# Altium project PCB_Project.PrjPcb
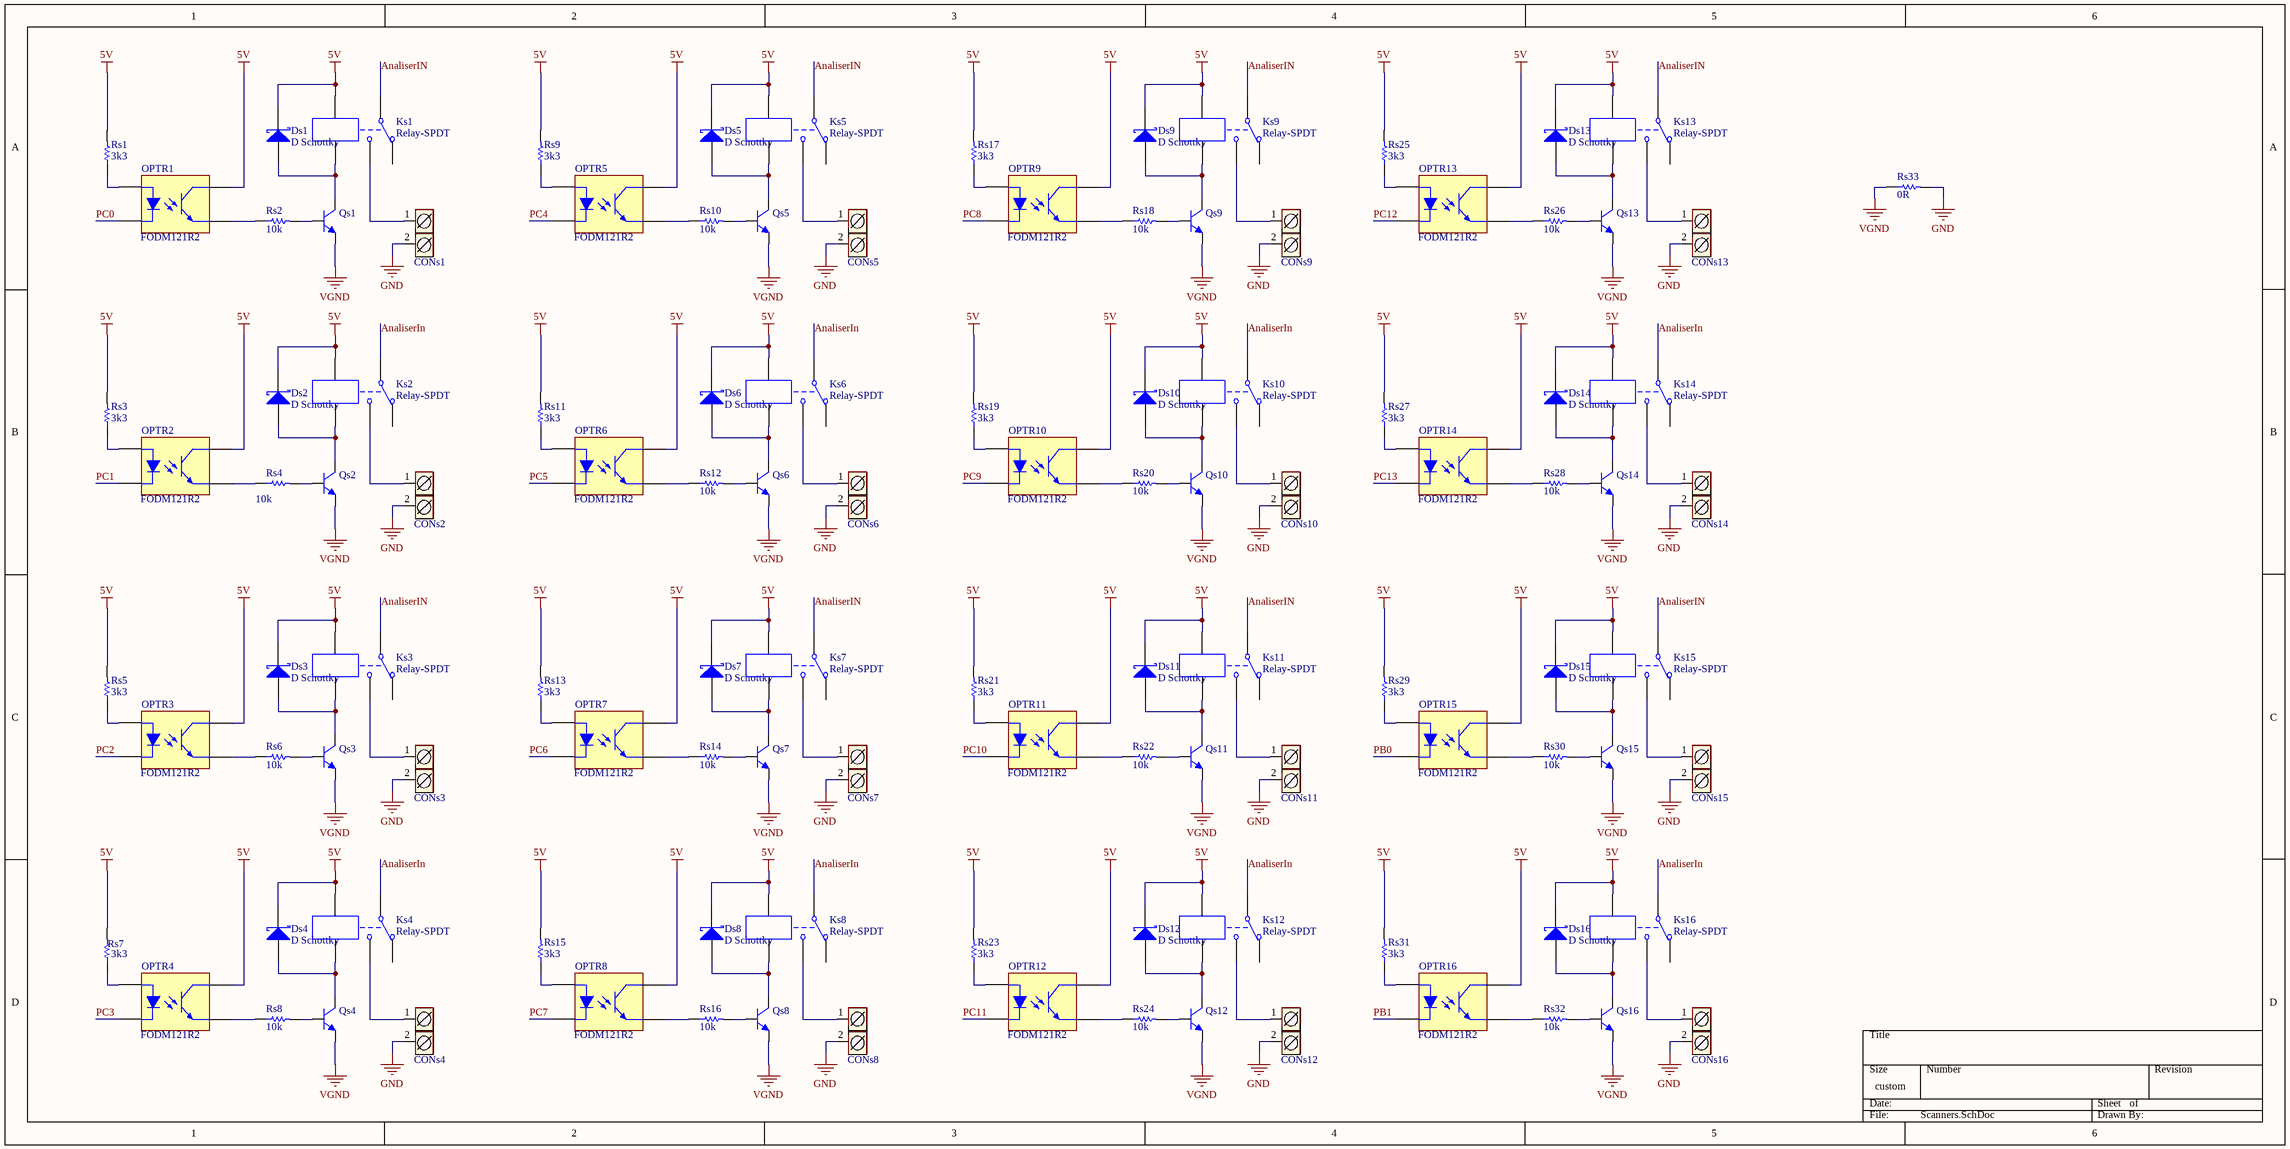
[diagram p0: Scanners.SchDoc]
5 sheets, 192 parts. Net scope: global (net labels, ports and power ports of the same name join across sheets).
Board file: PCB2.PcbDoc
Sheets:
  Scanners.SchDoc
  Connectors.SchDoc
  MCU.SchDoc
  Analiser.SchDoc
  Misc.SchDoc

## Sheet Scanners.SchDoc
size 508 x 254 mm

### Parts
CONs1  ARK2  [ARK2]  (value not drawn)
CONs2  ARK2  [ARK2]  (value not drawn)
CONs3  ARK2  [ARK2]  (value not drawn)
CONs4  ARK2  [ARK2]  (value not drawn)
CONs5  ARK2  [ARK2]  (value not drawn)
CONs6  ARK2  [ARK2]  (value not drawn)
CONs7  ARK2  [ARK2]  (value not drawn)
CONs8  ARK2  [ARK2]  (value not drawn)
CONs9  ARK2  [ARK2]  (value not drawn)
CONs10  ARK2  [ARK2]  (value not drawn)
CONs11  ARK2  [ARK2]  (value not drawn)
CONs12  ARK2  [ARK2]  (value not drawn)
CONs13  ARK2  [ARK2]  (value not drawn)
CONs14  ARK2  [ARK2]  (value not drawn)
CONs15  ARK2  [ARK2]  (value not drawn)
CONs16  ARK2  [ARK2]  (value not drawn)
Ds1  D Schottky  [SMA]
Ds2  D Schottky  [SMA]
Ds3  D Schottky  [SMA]
Ds4  D Schottky  [SMA]
Ds5  D Schottky  [SMA]
Ds6  D Schottky  [SMA]
Ds7  D Schottky  [SMA]
Ds8  D Schottky  [SMA]
Ds9  D Schottky  [SMA]
Ds10  D Schottky  [SMA]
Ds11  D Schottky  [SMA]
Ds12  D Schottky  [SMA]
Ds13  D Schottky  [SMA]
Ds14  D Schottky  [SMA]
Ds15  D Schottky  [SMA]
Ds16  D Schottky  [SMA]
Ks1  Relay-SPDT  [Relay_m1]
Ks2  Relay-SPDT  [Relay_m1]
Ks3  Relay-SPDT  [Relay_m1]
Ks4  Relay-SPDT  [Relay_m1]
Ks5  Relay-SPDT  [Relay_m1]
Ks6  Relay-SPDT  [Relay_m1]
Ks7  Relay-SPDT  [Relay_m1]
Ks8  Relay-SPDT  [Relay_m1]
Ks9  Relay-SPDT  [Relay_m1]
Ks10  Relay-SPDT  [Relay_m1]
Ks11  Relay-SPDT  [Relay_m1]
Ks12  Relay-SPDT  [Relay_m1]
Ks13  Relay-SPDT  [Relay_m1]
Ks14  Relay-SPDT  [Relay_m1]
Ks15  Relay-SPDT  [Relay_m1]
Ks16  Relay-SPDT  [Relay_m1]
OPTR1  FODM121R2  [FAIR-MFP 4L_V]
OPTR2  FODM121R2  [FAIR-MFP 4L_V]
OPTR3  FODM121R2  [FAIR-MFP 4L_V]
OPTR4  FODM121R2  [FAIR-MFP 4L_V]
OPTR5  FODM121R2  [FAIR-MFP 4L_V]
OPTR6  FODM121R2  [FAIR-MFP 4L_V]
OPTR7  FODM121R2  [FAIR-MFP 4L_V]
OPTR8  FODM121R2  [FAIR-MFP 4L_V]
OPTR9  FODM121R2  [FAIR-MFP 4L_V]
OPTR10  FODM121R2  [FAIR-MFP 4L_V]
OPTR11  FODM121R2  [FAIR-MFP 4L_V]
OPTR12  FODM121R2  [FAIR-MFP 4L_V]
OPTR13  FODM121R2  [FAIR-MFP 4L_V]
OPTR14  FODM121R2  [FAIR-MFP 4L_V]
OPTR15  FODM121R2  [FAIR-MFP 4L_V]
OPTR16  FODM121R2  [FAIR-MFP 4L_V]
Qs1  BC817-25  [SOT23_N]  (value not drawn)
Qs2  BC817-25  [SOT23_N]  (value not drawn)
Qs3  BC817-25  [SOT23_N]  (value not drawn)
Qs4  BC817-25  [SOT23_N]  (value not drawn)
Qs5  BC817-25  [SOT23_N]  (value not drawn)
Qs6  BC817-25  [SOT23_N]  (value not drawn)
Qs7  BC817-25  [SOT23_N]  (value not drawn)
Qs8  BC817-25  [SOT23_N]  (value not drawn)
Qs9  BC817-25  [SOT23_N]  (value not drawn)
Qs10  BC817-25  [SOT23_N]  (value not drawn)
Qs11  BC817-25  [SOT23_N]  (value not drawn)
Qs12  BC817-25  [SOT23_N]  (value not drawn)
Qs13  BC817-25  [SOT23_N]  (value not drawn)
Qs14  BC817-25  [SOT23_N]  (value not drawn)
Qs15  BC817-25  [SOT23_N]  (value not drawn)
Qs16  BC817-25  [SOT23_N]  (value not drawn)
Rs1  3k3  [RESC0603(1608)_L]
Rs2  10k  [RESC0603(1608)_L]
Rs3  3k3  [RESC0603(1608)_L]
Rs4  10k  [RESC0603(1608)_L]
Rs5  3k3  [RESC0603(1608)_L]
Rs6  10k  [RESC0603(1608)_L]
Rs7  3k3  [RESC0603(1608)_L]
Rs8  10k  [RESC0603(1608)_L]
Rs9  3k3  [RESC0603(1608)_L]
Rs10  10k  [RESC0603(1608)_L]
Rs11  3k3  [RESC0603(1608)_L]
Rs12  10k  [RESC0603(1608)_L]
Rs13  3k3  [RESC0603(1608)_L]
Rs14  10k  [RESC0603(1608)_L]
Rs15  3k3  [RESC0603(1608)_L]
Rs16  10k  [RESC0603(1608)_L]
Rs17  3k3  [RESC0603(1608)_L]
Rs18  10k  [RESC0603(1608)_L]
Rs19  3k3  [RESC0603(1608)_L]
Rs20  10k  [RESC0603(1608)_L]
Rs21  3k3  [RESC0603(1608)_L]
Rs22  10k  [RESC0603(1608)_L]
Rs23  3k3  [RESC0603(1608)_L]
Rs24  10k  [RESC0603(1608)_L]
Rs25  3k3  [RESC0603(1608)_L]
Rs26  10k  [RESC0603(1608)_L]
Rs27  3k3  [RESC0603(1608)_L]
Rs28  10k  [RESC0603(1608)_L]
Rs29  3k3  [RESC0603(1608)_L]
Rs30  10k  [RESC0603(1608)_L]
Rs31  3k3  [RESC0603(1608)_L]
Rs32  10k  [RESC0603(1608)_L]
Rs33  0R  [RESC0603(1608)_L]

### Nets
5V: Ds1.2(K) Ds2.2(K) Ds3.2(K) Ds4.2(K) Ds5.2(K) Ds6.2(K) Ds7.2(K) Ds8.2(K) Ds9.2(K) Ds10.2(K) Ds11.2(K) Ds12.2(K) Ds13.2(K) Ds14.2(K) Ds15.2(K) Ds16.2(K) Ks1.4 Ks2.4 Ks3.4 Ks4.4 Ks5.4 Ks6.4 Ks7.4 Ks8.4 Ks9.4 Ks10.4 Ks11.4 Ks12.4 Ks13.4 Ks14.4 Ks15.4 Ks16.4 OPTR1.4(COLLECTOR) OPTR2.4(COLLECTOR) OPTR3.4(COLLECTOR) OPTR4.4(COLLECTOR) OPTR5.4(COLLECTOR) OPTR6.4(COLLECTOR) OPTR7.4(COLLECTOR) OPTR8.4(COLLECTOR) OPTR9.4(COLLECTOR) OPTR10.4(COLLECTOR) OPTR11.4(COLLECTOR) OPTR12.4(COLLECTOR) OPTR13.4(COLLECTOR) OPTR14.4(COLLECTOR) OPTR15.4(COLLECTOR) OPTR16.4(COLLECTOR) Rs1.2 Rs3.2 Rs5.2 Rs7.2 Rs9.2 Rs11.2 Rs13.2 Rs15.2 Rs17.2 Rs19.2 Rs21.2 Rs23.2 Rs25.2 Rs27.2 Rs29.2 Rs31.2
GND: CONs1.2 CONs2.2 CONs3.2 CONs4.2 CONs5.2 CONs6.2 CONs7.2 CONs8.2 CONs9.2 CONs10.2 CONs11.2 CONs12.2 CONs13.2 CONs14.2 CONs15.2 CONs16.2 Rs33.2
VGND: Qs1.2(E) Qs2.2(E) Qs3.2(E) Qs4.2(E) Qs5.2(E) Qs6.2(E) Qs7.2(E) Qs8.2(E) Qs9.2(E) Qs10.2(E) Qs11.2(E) Qs12.2(E) Qs13.2(E) Qs14.2(E) Qs15.2(E) Qs16.2(E) Rs33.1
AnaliserIN: Ks1.1 Ks2.1 Ks3.1 Ks4.1 Ks5.1 Ks6.1 Ks7.1 Ks8.1 Ks9.1 Ks10.1 Ks11.1 Ks12.1 Ks13.1 Ks14.1 Ks15.1 Ks16.1
PB0: OPTR15.2(CATHODE)
PB1: OPTR16.2(CATHODE)
PC0: OPTR1.2(CATHODE)
PC1: OPTR2.2(CATHODE)
PC2: OPTR3.2(CATHODE)
PC3: OPTR4.2(CATHODE)
PC4: OPTR5.2(CATHODE)
PC5: OPTR6.2(CATHODE)
PC6: OPTR7.2(CATHODE)
PC7: OPTR8.2(CATHODE)
PC8: OPTR9.2(CATHODE)
PC9: OPTR10.2(CATHODE)
PC10: OPTR11.2(CATHODE)
PC11: OPTR12.2(CATHODE)
PC12: OPTR13.2(CATHODE)
PC13: OPTR14.2(CATHODE)
NetCONs1_1: CONs1.1 Ks1.3
NetCONs2_1: CONs2.1 Ks2.3
NetCONs3_1: CONs3.1 Ks3.3
NetCONs4_1: CONs4.1 Ks4.3
NetCONs5_1: CONs5.1 Ks5.3
NetCONs6_1: CONs6.1 Ks6.3
NetCONs7_1: CONs7.1 Ks7.3
NetCONs8_1: CONs8.1 Ks8.3
NetCONs9_1: CONs9.1 Ks9.3
NetCONs10_1: CONs10.1 Ks10.3
NetCONs11_1: CONs11.1 Ks11.3
NetCONs12_1: CONs12.1 Ks12.3
NetCONs13_1: CONs13.1 Ks13.3
NetCONs14_1: CONs14.1 Ks14.3
NetCONs15_1: CONs15.1 Ks15.3
NetCONs16_1: CONs16.1 Ks16.3
NetDs1_1: Ds1.1(A) Ks1.5 Qs1.3(C)
NetDs2_1: Ds2.1(A) Ks2.5 Qs2.3(C)
NetDs3_1: Ds3.1(A) Ks3.5 Qs3.3(C)
NetDs4_1: Ds4.1(A) Ks4.5 Qs4.3(C)
NetDs5_1: Ds5.1(A) Ks5.5 Qs5.3(C)
NetDs6_1: Ds6.1(A) Ks6.5 Qs6.3(C)
NetDs7_1: Ds7.1(A) Ks7.5 Qs7.3(C)
NetDs8_1: Ds8.1(A) Ks8.5 Qs8.3(C)
NetDs9_1: Ds9.1(A) Ks9.5 Qs9.3(C)
NetDs10_1: Ds10.1(A) Ks10.5 Qs10.3(C)
NetDs11_1: Ds11.1(A) Ks11.5 Qs11.3(C)
NetDs12_1: Ds12.1(A) Ks12.5 Qs12.3(C)
NetDs13_1: Ds13.1(A) Ks13.5 Qs13.3(C)
NetDs14_1: Ds14.1(A) Ks14.5 Qs14.3(C)
NetDs15_1: Ds15.1(A) Ks15.5 Qs15.3(C)
NetDs16_1: Ds16.1(A) Ks16.5 Qs16.3(C)
NetOPTR1_1: OPTR1.1(ANODE) Rs1.1
NetOPTR1_3: OPTR1.3(EMITTER) Rs2.1
NetOPTR2_1: OPTR2.1(ANODE) Rs3.1
NetOPTR2_3: OPTR2.3(EMITTER) Rs4.1
NetOPTR3_1: OPTR3.1(ANODE) Rs5.1
NetOPTR3_3: OPTR3.3(EMITTER) Rs6.1
NetOPTR4_1: OPTR4.1(ANODE) Rs7.1
NetOPTR4_3: OPTR4.3(EMITTER) Rs8.1
NetOPTR5_1: OPTR5.1(ANODE) Rs9.1
NetOPTR5_3: OPTR5.3(EMITTER) Rs10.1
NetOPTR6_1: OPTR6.1(ANODE) Rs11.1
NetOPTR6_3: OPTR6.3(EMITTER) Rs12.1
NetOPTR7_1: OPTR7.1(ANODE) Rs13.1
NetOPTR7_3: OPTR7.3(EMITTER) Rs14.1
NetOPTR8_1: OPTR8.1(ANODE) Rs15.1
NetOPTR8_3: OPTR8.3(EMITTER) Rs16.1
NetOPTR9_1: OPTR9.1(ANODE) Rs17.1
NetOPTR9_3: OPTR9.3(EMITTER) Rs18.1
NetOPTR10_1: OPTR10.1(ANODE) Rs19.1
NetOPTR10_3: OPTR10.3(EMITTER) Rs20.1
NetOPTR11_1: OPTR11.1(ANODE) Rs21.1
NetOPTR11_3: OPTR11.3(EMITTER) Rs22.1
NetOPTR12_1: OPTR12.1(ANODE) Rs23.1
NetOPTR12_3: OPTR12.3(EMITTER) Rs24.1
NetOPTR13_1: OPTR13.1(ANODE) Rs25.1
NetOPTR13_3: OPTR13.3(EMITTER) Rs26.1
NetOPTR14_1: OPTR14.1(ANODE) Rs27.1
NetOPTR14_3: OPTR14.3(EMITTER) Rs28.1
NetOPTR15_1: OPTR15.1(ANODE) Rs29.1
NetOPTR15_3: OPTR15.3(EMITTER) Rs30.1
NetOPTR16_1: OPTR16.1(ANODE) Rs31.1
NetOPTR16_3: OPTR16.3(EMITTER) Rs32.1
NetQs1_1: Qs1.1(B) Rs2.2
NetQs2_1: Qs2.1(B) Rs4.2
NetQs3_1: Qs3.1(B) Rs6.2
NetQs4_1: Qs4.1(B) Rs8.2
NetQs5_1: Qs5.1(B) Rs10.2
NetQs6_1: Qs6.1(B) Rs12.2
NetQs7_1: Qs7.1(B) Rs14.2
NetQs8_1: Qs8.1(B) Rs16.2
NetQs9_1: Qs9.1(B) Rs18.2
NetQs10_1: Qs10.1(B) Rs20.2
NetQs11_1: Qs11.1(B) Rs22.2
NetQs12_1: Qs12.1(B) Rs24.2
NetQs13_1: Qs13.1(B) Rs26.2
NetQs14_1: Qs14.1(B) Rs28.2
NetQs15_1: Qs15.1(B) Rs30.2
NetQs16_1: Qs16.1(B) Rs32.2

Not connected (* = marked no-connect by the designer): Ks1 2; Ks2 2; Ks3 2; Ks4 2; Ks5 2; Ks6 2; Ks7 2; Ks8 2; Ks9 2; Ks10 2; Ks11 2; Ks12 2; Ks13 2; Ks14 2; Ks15 2; Ks16 2

### Library data of the parts
CONs1-CONs16 = ARK2: Złącze śrubowe 2 piny
Ds1-Ds16 = D Schottky: Schottky Diode; Published: 8-Jun-2000; LatestRevisionDate: 17-Jul-2002; LatestRevisionNote: Re-released for DXP Platform.; PackageReference: SMB; Publisher: Altium Limited; PackageDescription: DO-214-AA/SMB; 2 C-Bend Leads; Body 5.3 x 3.6 mm, inc. leads (LxW); Code_JEDEC: DO-214-AA
Ks1-Ks16 = Relay-SPDT: Single-Pole Dual-Throw Relay; Published: 24-Mar-1999; LatestRevisionDate: 17-Jul-2002; LatestRevisionNote: Re-released for DXP Platform.; PackageReference: MODULE5B; Publisher: Altium Limited
OPTR1-OPTR16 = CMP-1569-00003-1: Transistor Output Optocoupler, 1 to 1.3 V, -40 to 110 degC, 4-Pin SOP (MFP 4L), RoHS, Tape and Reel; VCE Saturation Max: 0.4 V; Forward Voltage Max: 1.3 V; Forward Voltage Min: 1 V; ComponentLink3URL: https://www.fairchildsemi.com/package-drawings/MF/MFP04C.pdf; Temperature Max: 110 degC; RoHS: TRUE; DatasheetVersion: Rev. 1.1.4; Temperature Min: -40 degC; Mounting Technology: Surface Mount; ComponentLink2Description: Datasheet; ComponentLink2URL: https://www.fairchildsemi.com/datasheets/FO/FODM121.pdf; ComponentLink1Description: Manufacturer URL; ComponentLink1URL: https://www.fairchildsemi.com/; ComponentLink3Description: Package Specification; PartNumber: FODM121; Packing: Tape and Reel; PackageDescription: 4-Pin Mini Flat Package, Body 3.85 x 4.4 mm, Pitch 2.54 mm
Qs1-Qs16 = BC817-25: NPN General-purpose Transistor; Published: 17-Sep-2003; LatestRevisionDate: 12-Dec-2006; LatestRevisionNote: IPC-7351 Footprint Added.; DatasheetVersion: Jun-1999; PackageVersion: May-1999; PackageReference: SOT23; Publisher: Altium Limited; PackageDescription: 3-Pin SOT-23 Package 0.95 mm Pitch, 2.3 mm Lead Span; ComponentLink1Description: Manufacturer Link; ComponentLink1URL: http://www.semiconductors.philips.com/; ComponentLink2Description: Datasheet; ComponentLink2URL: http://www.semiconductors.philips.com/acrobat/datasheets/BC817_BC817W_BC337_5.pdf
Rs1-Rs33 = CMP-1591-00001-1: 0603 (1608 Metric) Chip Resistor; Case-Metric: 1608; Case-EIA: 0603; PackageReference: RESC0603(1608)

## Sheet Connectors.SchDoc
size A4
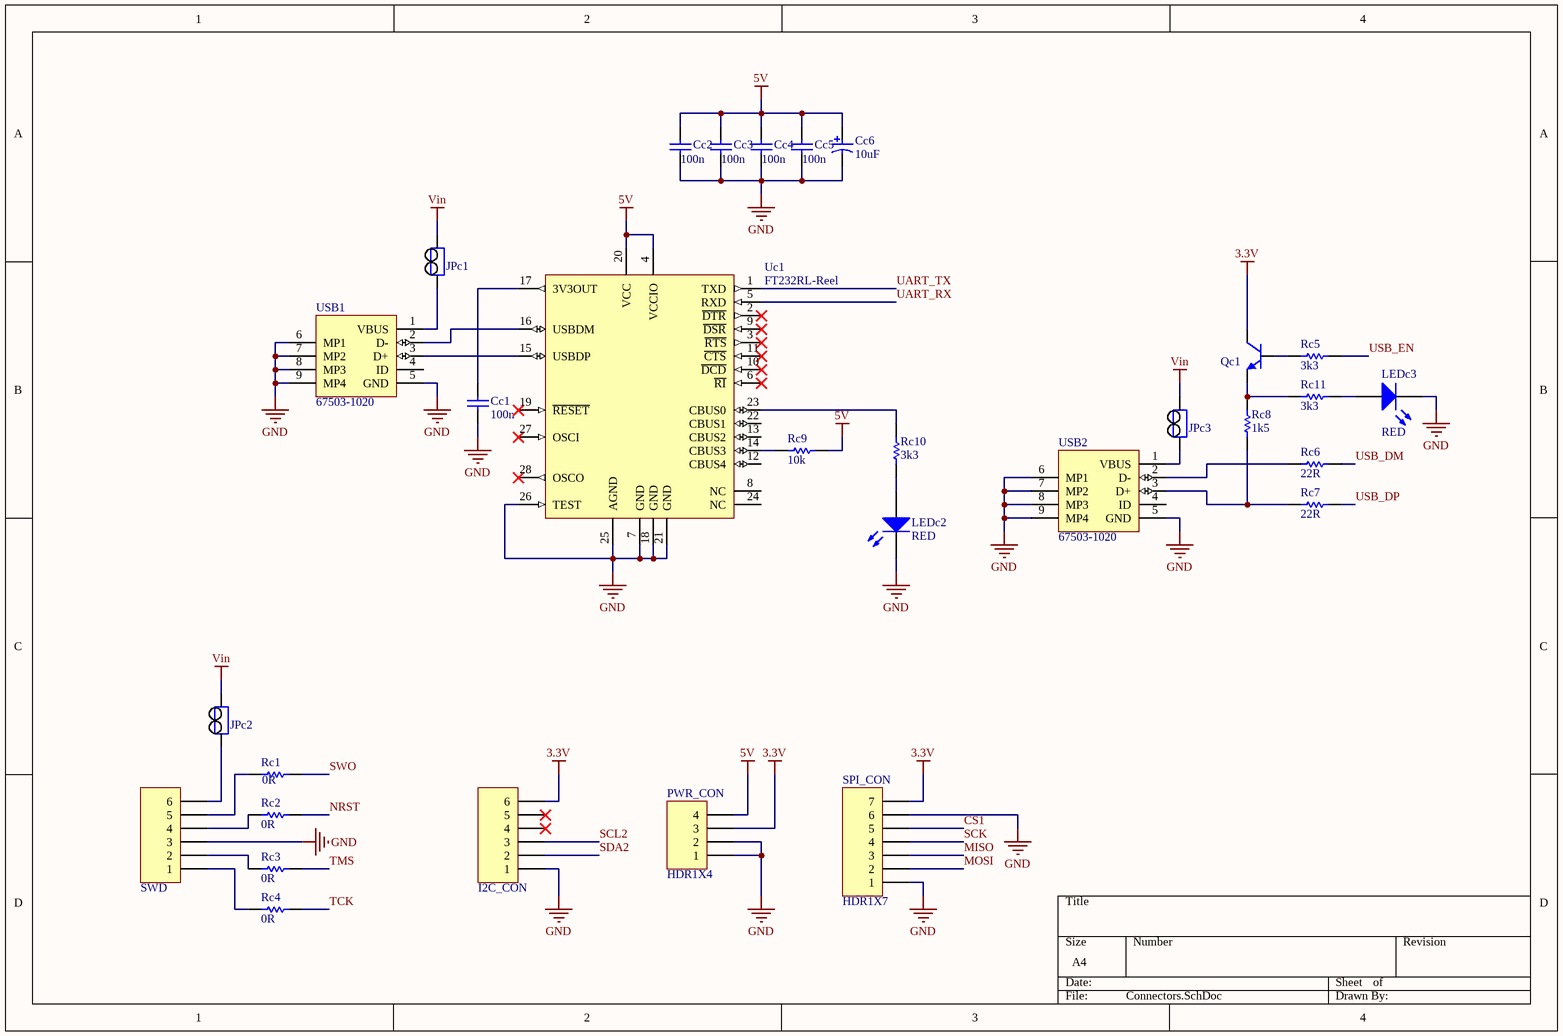
[diagram p1: Connectors.SchDoc]

### Parts
Cc1  100n  [CAPC0603(1608)100_L]
Cc2  100n  [CAPC0603(1608)100_L]
Cc3  100n  [CAPC0603(1608)100_L]
Cc4  100n  [CAPC0603(1608)100_L]
Cc5  100n  [CAPC0603(1608)100_L]
Cc6  10uF  [CAPMP3217X18-T_V]
I2C_CON  HDR1X6  [HDR1X6]  (value not drawn)
JPc1  Jumper  [HDR1X2 - JP]  (value not drawn)
JPc2  Jumper  [HDR1X2 - JP]  (value not drawn)
JPc3  Jumper  [HDR1X2 - JP]  (value not drawn)
LEDc2  RED  [0805_DIODE]
LEDc3  RED  [0805_DIODE]
PWR_CON  HDR1X4  [HDR1X4]
Qc1  BC817-25  [SOT23_N]  (value not drawn)
Rc1  0R  [RESC0603(1608)_L]
Rc2  0R  [RESC0603(1608)_L]
Rc3  0R  [RESC0603(1608)_L]
Rc4  0R  [RESC0603(1608)_L]
Rc5  3k3  [RESC0603(1608)_L]
Rc6  22R  [RESC0603(1608)_L]
Rc7  22R  [RESC0603(1608)_L]
Rc8  1k5  [RESC0603(1608)_L]
Rc9  10k  [RESC0603(1608)_L]
Rc10  3k3  [RESC0603(1608)_L]
Rc11  3k3  [RESC0603(1608)_L]
SPI_CON  HDR1X7  [HDR1X7]
SWD  HDR1X6  [HDR1X6]  (value not drawn)
Uc1  FT232RL-Reel  [SSOP-28_L]
USB1  67503-1020  [MOLX-67503-1020_V]
USB2  67503-1020  [MOLX-67503-1020_V]

### Nets
3.3V: I2C_CON.6 PWR_CON.3 Qc1.3(C) SPI_CON.7
5V: Cc2.2 Cc3.2 Cc4.2 Cc5.2 Cc6.1 PWR_CON.4 Rc9.1 Uc1.4(VCCIO) Uc1.20(VCC)
GND: Cc1.1 Cc2.1 Cc3.1 Cc4.1 Cc5.1 Cc6.2 I2C_CON.1 LEDc2.2(K) LEDc3.2(K) PWR_CON.1 PWR_CON.2 SPI_CON.1 SPI_CON.6 SWD.3 Uc1.7(GND) Uc1.18(GND) Uc1.21(GND) Uc1.25(AGND) Uc1.26(TEST) USB1.5(GND) USB1.6(MP1) USB1.7(MP2) USB1.8(MP3) USB1.9(MP4) USB2.5(GND) USB2.6(MP1) USB2.7(MP2) USB2.8(MP3) USB2.9(MP4)
Vin: JPc1.2 JPc2.2 JPc3.2
CS1: SPI_CON.5
MISO: SPI_CON.3
MOSI: SPI_CON.2
NRST: Rc2.2
SCK: SPI_CON.4
SCL2: I2C_CON.3
SDA2: I2C_CON.2
SWO: Rc1.2
TCK: Rc4.2
TMS: Rc3.2
UART_RX: Uc1.5(RXD)
UART_TX: Uc1.1(TXD)
USB_DM: Rc6.2
USB_DP: Rc7.2
USB_EN: Rc5.1
NetCc1_2: Cc1.2 Uc1.17(3V3OUT)
NetJPc1_1: JPc1.1 USB1.1(VBUS)
NetJPc2_1: JPc2.1 SWD.6
NetJPc3_1: JPc3.1 USB2.1(VBUS)
NetLEDc2_1: LEDc2.1(A) Rc10.1
NetLEDc3_1: LEDc3.1(A) Rc11.1
NetQc1_1: Qc1.1(B) Rc5.2
NetQc1_2: Qc1.2(E) Rc8.2 Rc11.2
NetRc1_1: Rc1.1 SWD.5
NetRc2_1: Rc2.1 SWD.4
NetRc3_1: Rc3.1 SWD.2
NetRc4_1: Rc4.1 SWD.1
NetRc6_1: Rc6.1 USB2.2(D-)
NetRc7_1: Rc7.1 Rc8.1 USB2.3(D+)
NetRc9_2: Rc9.2 Uc1.14(CBUS3)
NetRc10_2: Rc10.2 Uc1.23(CBUS0)
NetUc1_15: Uc1.15(USBDP) USB1.3(D+)
NetUc1_16: Uc1.16(USBDM) USB1.2(D-)

Not connected (* = marked no-connect by the designer): I2C_CON 4* 5*; Uc1 2(~{DTR})* 3(~{RTS})* 6(~{RI})* 8(NC) 9(~{DSR})* 10(~{DCD})* 11(~{CTS})* 12(CBUS4) 13(CBUS2) 19(~{RESET})* 22(CBUS1) 24(NC) 27(OSCI)* 28(OSCO)*; USB1 4(ID); USB2 4(ID)

### Library data of the parts
Cc1-Cc5 = CMP-1590-00005-1: 0603 (1608 Metric) Chip Capacitor; Case-Metric: 1608; Case-EIA: 0603; PackageReference: CAPC0603(1608)100
Cc6 = CMP-1661-00003-1: Standard Tantalum, 1 uF, +/- 10%, 35 V, -55 to 125 degC, 2-Pin SMD (1206), RoHS, Tape and Reel; Current Rating: 200 mA; Voltage Rating (DC): 30 V; REACH SVHC: No SVHC; ComponentLink2URL: http://datasheets.avx.com/TAJ.pdf; Pins: 3; PackageReference: CAPMP3217X18-T; Width: 4 mm; ComponentLink3Description: Package Specification; Length: 11.6 mm; PackageDescription: 2-Pin Surface Mount Device, Body 3.2 x 1.65 mm; ComponentLink2Description: Datasheet; Max Operating Temperature: 70 degC; Contact Material: Copper; Contact Finish: Silver; DatasheetVersion: Feb-16; Contact Plating: Silver; Package Quantity: 1000; Height: 7.4 mm; Min Operating Temperature: -20 degC; Packaging: Bulk; RoHSCompliant: true; ComponentLink1URL: http://www.avx.com/; Mount: Through Hole; ComponentLink1Description: Manufacturer URL; ComponentLink3URL: http://www.avx.com/download/software/literature/AVX-Footprint-Library.pdf
I2C_CON SWD = HDR1X6: Header, 6-Pin; LatestRevisionDate: 17-Jul-2002; LatestRevisionNote: Re-released for DXP Platform.; Publisher: Altium Limited
JPc1-JPc3 = Jumper_2: Jumper, 2-Pin
LEDc2 LEDc3 = LED: Light-emitting diode; COLOR: RED
PWR_CON = HDR1X4: Header, 4-Pin; LatestRevisionDate: 17-Jul-2002; LatestRevisionNote: Re-released for DXP Platform.; Publisher: Altium Limited
Qc1 = BC817-25: NPN General-purpose Transistor; Published: 17-Sep-2003; LatestRevisionDate: 12-Dec-2006; LatestRevisionNote: IPC-7351 Footprint Added.; DatasheetVersion: Jun-1999; PackageVersion: May-1999; PackageReference: SOT23; Publisher: Altium Limited; PackageDescription: 3-Pin SOT-23 Package 0.95 mm Pitch, 2.3 mm Lead Span; ComponentLink1Description: Manufacturer Link; ComponentLink1URL: http://www.semiconductors.philips.com/; ComponentLink2Description: Datasheet; ComponentLink2URL: http://www.semiconductors.philips.com/acrobat/datasheets/BC817_BC817W_BC337_5.pdf
Rc1-Rc11 = CMP-1591-00001-1: as Rs1 on sheet Scanners; PackageReference: RESC0603(1608)
SPI_CON = HDR1X7: Header, 7-Pin; LatestRevisionDate: 17-Jul-2002; LatestRevisionNote: Re-released for DXP Platform.; Publisher: Altium Limited
Uc1 = CMP-0078-00029-3: USB UART Asynchronous Serial Data Transfer Chip, 28-pin SSOP, Tape and Reel; Manufacturer: FTDI; PackageVersion: Mar-12; PackageReference: SSOP-28; ComponentLink2Description: Datasheet; DatasheetVersion: ver 2.10, Mar-2012; PackageDescription: 28-Pin Small Outline Package 0.65 mm Pitch; ComponentLink1Description: Manufacturer URL; RevisionNote: DatasheetVersion updated to 2.10 Mar-2012; PartNumber: FT232RL-Reel; ComponentLink1URL: http://www.ftdichip.com/; ComponentLink2URL: http://www.ftdichip.com/Support/Documents/DataSheets/ICs/DS_FT232R.pdf
USB1 USB2 = CMP-0411-00002-1: USB, MINI, SMD, RA KME04-USBMU03A01; Manufacturer: Molex; ComponentLink1URL: http://www.molex.com/; PartNumber: 67503-1020; Mounting Technology: Surface Mount; ComponentLink1Description: Manufacturer URL; Terminal Pitch: 0.8 mm; DatasheetVersion: Rev F, 06/2009; ComponentLink2Description: Datasheet; PackageDescription: Mini USB Connector, SMT, Righer Angle; ComponentLink2URL: http://www.molex.com/pdm_docs/sd/675031020_sd.pdf; PackageReference: 67503-1020

## Sheet MCU.SchDoc
size A4
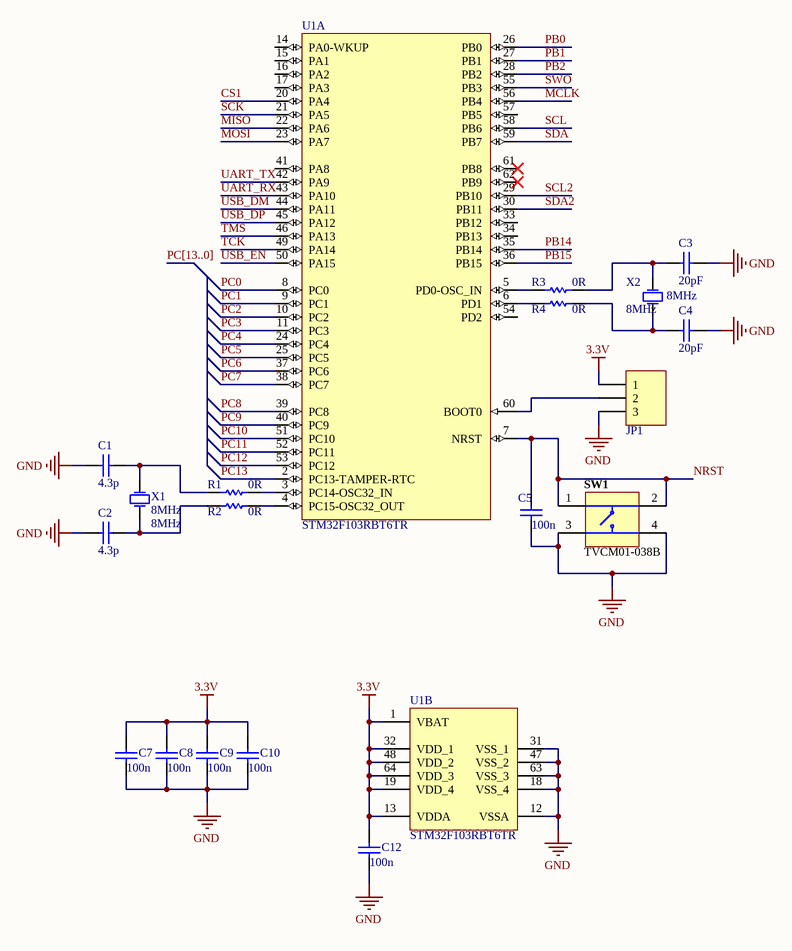
[diagram p2: MCU.SchDoc]

### Parts
C1  4.3p  [CAPC0603(1608)100_L]
C2  4.3p  [CAPC0603(1608)100_L]
C3  20pF  [CAPC0603(1608)100_L]
C4  20pF  [CAPC0603(1608)100_L]
C5  100n  [CAPC0603(1608)100_L]
C7  100n  [CAPC0603(1608)100_L]
C8  100n  [CAPC0603(1608)100_L]
C9  100n  [CAPC0603(1608)100_L]
C10  100n  [CAPC0603(1608)100_L]
C12  100n  [CAPC0603(1608)100_L]
JP1  HDR1X3  [HDR1X3]  (value not drawn)
R1  0R  [RESC0603(1608)_L]
R2  0R  [RESC0603(1608)_L]
R3  0R  [RESC0603(1608)_L]
R4  0R  [RESC0603(1608)_L]
SW1  TVCM01-038B  [JNFU-TVCM01-038B_V]
U1  STM32F103RBT6TR  [LQFP64_N]  (parts A,B of 2)
X1  8MHz  [HC49/4H_SMX]
X2  8MHz  [HC49/4H_SMX]

### Nets
3.3V: C7.2 C8.2 C9.2 C10.2 C12.2 JP1.1 U1.1(VBAT) U1.13(VDDA) U1.19(VDD_4) U1.32(VDD_1) U1.48(VDD_2) U1.64(VDD_3)
GND: C1.1 C2.1 C3.1 C4.1 C5.2 C7.1 C8.1 C9.1 C10.1 C12.1 JP1.3 SW1.3 SW1.4 U1.12(VSSA) U1.18(VSS_4) U1.31(VSS_1) U1.47(VSS_2) U1.63(VSS_3)
CS1: U1.20(PA4)
MCLK: U1.56(PB4)
MISO: U1.22(PA6)
MOSI: U1.23(PA7)
NRST: C5.1 SW1.1 SW1.2 U1.7(NRST)
PB0: U1.26(PB0)
PB1: U1.27(PB1)
PB2: U1.28(PB2)
PB14: U1.35(PB14)
PB15: U1.36(PB15)
PC0: U1.8(PC0)
PC1: U1.9(PC1)
PC2: U1.10(PC2)
PC3: U1.11(PC3)
PC4: U1.24(PC4)
PC5: U1.25(PC5)
PC6: U1.37(PC6)
PC7: U1.38(PC7)
PC8: U1.39(PC8)
PC9: U1.40(PC9)
PC10: U1.51(PC10)
PC11: U1.52(PC11)
PC12: U1.53(PC12)
PC13: U1.2(PC13-TAMPER-RTC)
SCK: U1.21(PA5)
SCL: U1.58(PB6)
SCL2: U1.29(PB10)
SDA: U1.59(PB7)
SDA2: U1.30(PB11)
SWO: U1.55(PB3)
TCK: U1.49(PA14)
TMS: U1.46(PA13)
UART_RX: U1.43(PA10)
UART_TX: U1.42(PA9)
USB_DM: U1.44(PA11)
USB_DP: U1.45(PA12)
USB_EN: U1.50(PA15)
NetC1_2: C1.2 R1.1 X1.2(OSC2)
NetC2_2: C2.2 R2.1 X1.1(OSC1)
NetC3_2: C3.2 R3.1 X2.1(OSC1)
NetC4_2: C4.2 R4.1 X2.2(OSC2)
NetJP1_2: JP1.2 U1.60(BOOT0)
NetR1_2: R1.2 U1.3(PC14-OSC32_IN)
NetR2_2: R2.2 U1.4(PC15-OSC32_OUT)
NetR3_2: R3.2 U1.5(PD0-OSC_IN)
NetR4_2: R4.2 U1.6(PD1)

Not connected (* = marked no-connect by the designer): U1 14(PA0-WKUP) 15(PA1) 16(PA2) 17(PA3) 33(PB12) 34(PB13) 41(PA8) 54(PD2) 57(PB5) 61(PB8)* 62(PB9)*

### Buses and harness runs
bus PC[13..0]

### Library data of the parts
C1-C5 C7-C10 C12 = CMP-1590-00005-1: as Cc1 on sheet Connectors; PackageReference: CAPC0603(1608)100
JP1 = HDR1X3: Header, 3-Pin; LatestRevisionDate: 17-Jul-2002; LatestRevisionNote: Re-released for DXP Platform.; Publisher: Altium Limited
R1-R4 = CMP-1591-00001-1: as Rs1 on sheet Scanners; PackageReference: RESC0603(1608)
SW1 = CMP-0224-00001-1: Switch, Push Button, 50 mA, 12V DC, SMD; Mechanical Life: 100,000 cycles; PackageReference: TVCM01-038B; Operating Temperature: -30 to 85 degC; ComponentLink1URL: http://www.jian-fu.com/; ComponentLink2Description: Datasheet; Mounting Technology: Suface Mount; Case Size: 4.5 x 4.5; ComponentLink1Description: Manufacturer URL; PartNumber: TVCM01-038B; ComponentLink2URL: http://www.jian-fu.com/product-61.html; PackageDescription: 4-Pin Surface Mount Switch, 4.5 x 4.5 mm Body
U1 = CMP-0237-00169-1: STM32 ARM-based 32-bit MCU Performance Line with 128 kB Flash, 20 kB Internal RAM, -40 to +85°C Temperature, 64-Pin LQFP, Tape and Reel; ComponentLink1Description: STM32F103 Datasheet; DatasheetVersion: rev13.0, Apr-2011; ComponentLink2URL: www.st.com/stm32; ComponentLink1URL: http://www.st.com/internet/com/TECHNICAL_RESOURCES/TECHNICAL_LITERATURE/DATASHEET/CD00161566.pdf; PackageDescription: 64-Pin Low-Profile Quad Flat Pack, 10 x 10 mm Body, 0.5 mm Pitch (LQFP64); PackageVersion: rev13, Apr-2011; PackageReference: LQFP64; ComponentLink3Description: st.com Home; ComponentLink2Description: STM32 Family Web Page; ComponentLink3URL: http://www.st.com/internet/com/home/home.jsp
X1 X2 = XTAL: Oscillator; Unit Price1: *; Unit Price2: *; Value: 8MHz

## Sheet Analiser.SchDoc
size A4
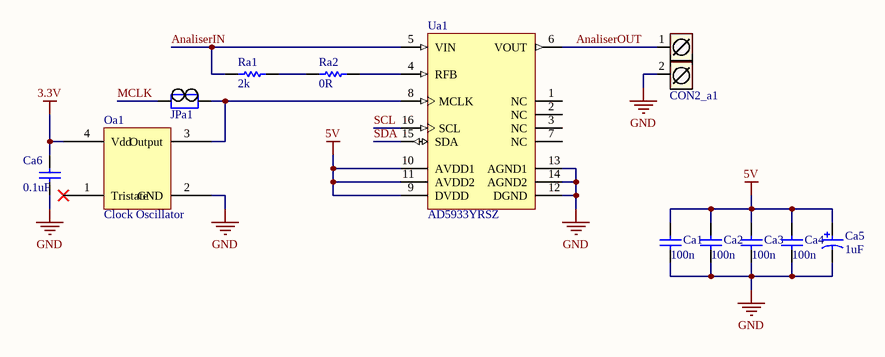
[diagram p3: Analiser.SchDoc]

### Parts
Ca1  100n  [CAPC0603(1608)100_L]
Ca2  100n  [CAPC0603(1608)100_L]
Ca3  100n  [CAPC0603(1608)100_L]
Ca4  100n  [CAPC0603(1608)100_L]
Ca5  1uF  [CAPMP3217X18-T_V]
Ca6  0.1uF  [CAPC0603(1608)100_L]
CON2_a1  ARK2  [ARK2]  (value not drawn)
JPa1  Jumper  [HDR1X2 - JP]  (value not drawn)
Oa1  Clock Oscillator  [Oscillator SMD]
Ra1  2k  [RESC0603(1608)_L]
Ra2  0R  [RESC0603(1608)_L]
Ua1  AD5933YRSZ  [ADI-RS-16_L]

### Nets
3.3V: Ca6.2 Oa1.4(Vdd)
5V: Ca1.2 Ca2.2 Ca3.2 Ca4.2 Ca5.1 Ua1.9(DVDD) Ua1.10(AVDD1) Ua1.11(AVDD2)
GND: Ca1.1 Ca2.1 Ca3.1 Ca4.1 Ca5.2 Ca6.1 CON2_a1.2 Oa1.2(GND) Ua1.12(DGND) Ua1.13(AGND1) Ua1.14(AGND2)
AnaliserIN: Ra1.1 Ua1.5(VIN)
AnaliserOUT: CON2_a1.1 Ua1.6(VOUT)
MCLK: JPa1.1
SCL: Ua1.16(SCL)
SDA: Ua1.15(SDA)
NetJPa1_2: JPa1.2 Oa1.3(Output) Ua1.8(MCLK)
NetRa1_2: Ra1.2 Ra2.1
NetRa2_2: Ra2.2 Ua1.4(RFB)

Not connected (* = marked no-connect by the designer): Oa1 1(Tristate)*; Ua1 1(NC) 2(NC) 3(NC) 7(NC)

### Library data of the parts
Ca1-Ca4 Ca6 = CMP-1590-00005-1: as Cc1 on sheet Connectors; PackageReference: CAPC0603(1608)100
Ca5 = CMP-1661-00003-1: as Cc6 on sheet Connectors; REACH SVHC: No SVHC; ComponentLink2URL: http://datasheets.avx.com/TAJ.pdf; Pins: 3; PackageReference: CAPMP3217X18-T; Width: 4 mm; ComponentLink3Description: Package Specification; Length: 11.6 mm; PackageDescription: 2-Pin Surface Mount Device, Body 3.2 x 1.65 mm; ComponentLink2Description: Datasheet; Max Operating Temperature: 70 degC; Contact Material: Copper; Contact Finish: Silver; DatasheetVersion: Feb-16; Contact Plating: Silver; Package Quantity: 1000; Height: 7.4 mm; Min Operating Temperature: -20 degC; Packaging: Bulk; RoHSCompliant: true; ComponentLink1URL: http://www.avx.com/; Mount: Through Hole; ComponentLink1Description: Manufacturer URL; ComponentLink3URL: http://www.avx.com/download/software/literature/AVX-Footprint-Library.pdf
CON2_a1 = ARK2: Złącze śrubowe 2 piny
JPa1 = Jumper_2: Jumper, 2-Pin
Oa1 = Clock Oscillator: 1.8MHz Clock Source SMD
Ra1 Ra2 = CMP-1591-00001-1: as Rs1 on sheet Scanners; PackageReference: RESC0603(1608)
Ua1 = CMP-0293-00046-1: 1 MSPS, 12-Bit Impedance Converter, Network Analyzer, Serial, RS-16, 77 Tube, Pb-Free; Tuning Word Width (bits): 27bit; I Supply total (max): 15mA; Master fclk: 16.776MHz; Resolution (Bits): 12bit; PackageVersion: 3/17/2005; I/O Interface: Serial; ComponentLink2URL: http://www.analog.com/static/imported-files/data_sheets/AD5933.pdf; PackageReference: RS-16; ComponentLink2Description: Datasheet; ComponentLink1URL: www.analog.com; Code_JEDEC: MO-150-AC; PackageDescription: 16-Lead Shrink Small Outline Package [SSOP]; ComponentLink1Description: Manufacturer URL; ComponentLink3URL: http://www.analog.com/static/imported-files/packages/31572257652246RS_16.pdf; ComponentLink3Description: Package Specification; DatasheetVersion: Rev. D

## Sheet Misc.SchDoc
size A4
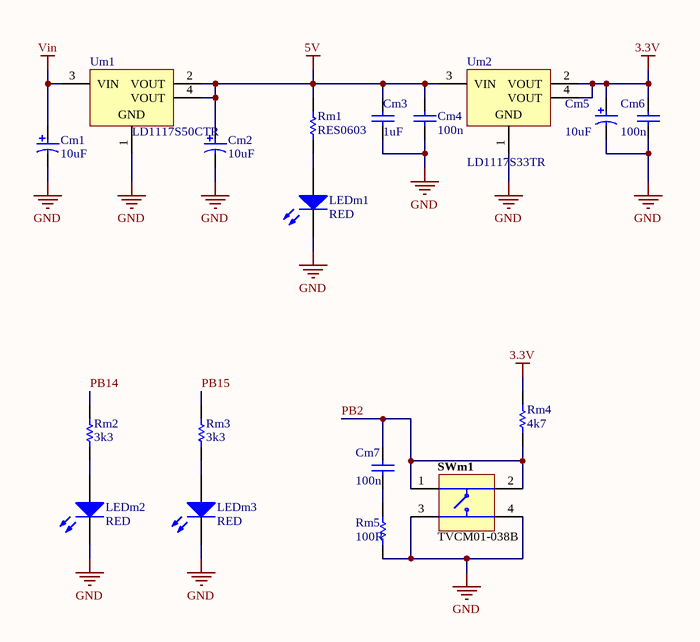
[diagram p4: Misc.SchDoc]

### Parts
Cm1  10uF  [CAPMP3217X18-T_V]
Cm2  10uF  [CAPMP3217X18-T_V]
Cm3  1uF  [CAPC0603(1608)100_L]
Cm4  100n  [CAPC0603(1608)100_L]
Cm5  10uF  [CAPMP3217X18-T_V]
Cm6  100n  [CAPC0603(1608)100_L]
Cm7  100n  [CAPC0603(1608)100_L]
LEDm1  RED  [0805_DIODE]
LEDm2  RED  [0805_DIODE]
LEDm3  RED  [0805_DIODE]
Rm1  RES0603  [RESC0603(1608)_L]
Rm2  3k3  [RESC0603(1608)_L]
Rm3  3k3  [RESC0603(1608)_L]
Rm4  4k7  [RESC0603(1608)_L]
Rm5  100R  [RESC0603(1608)_L]
SWm1  TVCM01-038B  [JNFU-TVCM01-038B_V]
Um1  LD1117S50CTR  [SOT-223_N]
Um2  LD1117S33TR  [SOT-223_L]

### Nets
3.3V: Cm5.1 Cm6.2 Rm4.2 Um2.2(VOUT) Um2.4(VOUT)
5V: Cm2.1 Cm3.2 Cm4.2 Rm1.2 Um1.2(VOUT) Um1.4(VOUT) Um2.3(VIN)
GND: Cm1.2 Cm2.2 Cm3.1 Cm4.1 Cm5.2 Cm6.1 LEDm1.2(K) LEDm2.2(K) LEDm3.2(K) Rm5.1 SWm1.3 SWm1.4 Um1.1(GND) Um2.1(GND)
Vin: Cm1.1 Um1.3(VIN)
PB2: Cm7.2 Rm4.1 SWm1.1 SWm1.2
PB14: Rm2.2
PB15: Rm3.2
NetCm7_1: Cm7.1 Rm5.2
NetLEDm1_1: LEDm1.1(A) Rm1.1
NetLEDm2_1: LEDm2.1(A) Rm2.1
NetLEDm3_1: LEDm3.1(A) Rm3.1

### Library data of the parts
Cm1 Cm2 Cm5 = CMP-1661-00003-1: as Cc6 on sheet Connectors; REACH SVHC: No SVHC; ComponentLink2URL: http://datasheets.avx.com/TAJ.pdf; Pins: 3; PackageReference: CAPMP3217X18-T; Width: 4 mm; ComponentLink3Description: Package Specification; Length: 11.6 mm; PackageDescription: 2-Pin Surface Mount Device, Body 3.2 x 1.65 mm; ComponentLink2Description: Datasheet; Max Operating Temperature: 70 degC; Contact Material: Copper; Contact Finish: Silver; DatasheetVersion: Feb-16; Contact Plating: Silver; Package Quantity: 1000; Height: 7.4 mm; Min Operating Temperature: -20 degC; Packaging: Bulk; RoHSCompliant: true; ComponentLink1URL: http://www.avx.com/; Mount: Through Hole; ComponentLink1Description: Manufacturer URL; ComponentLink3URL: http://www.avx.com/download/software/literature/AVX-Footprint-Library.pdf
Cm3 Cm4 Cm6 Cm7 = CMP-1590-00005-1: as Cc1 on sheet Connectors; PackageReference: CAPC0603(1608)100
LEDm1-LEDm3 = LED: Light-emitting diode; COLOR: RED
Rm1-Rm5 = CMP-1591-00001-1: as Rs1 on sheet Scanners; PackageReference: RESC0603(1608)
SWm1 = CMP-0224-00001-1: as SW1 on sheet MCU; PackageReference: TVCM01-038B; Operating Temperature: -30 to 85 degC; ComponentLink1URL: http://www.jian-fu.com/; ComponentLink2Description: Datasheet; Mounting Technology: Suface Mount; Case Size: 4.5 x 4.5; ComponentLink1Description: Manufacturer URL; PartNumber: TVCM01-038B; ComponentLink2URL: http://www.jian-fu.com/product-61.html; PackageDescription: 4-Pin Surface Mount Switch, 4.5 x 4.5 mm Body
Um1 = CMP-0244-00311-1: Fixed Low Drop Positive Voltage Regulator, 5V, 4-Pin SOT-223, Tape and Reel; PackageReference: SOT-223; PackageVersion: 2010; ComponentLink2URL: http://www.st.com/internet/com/TECHNICAL_RESOURCES/TECHNICAL_LITERATURE/DATASHEET/CD00000544.pdf; ComponentLink1URL: http://www.st.com; ComponentLink2Description: Datasheet; DatasheetVersion: 1/11/2011; ComponentLink1Description: Manufacturer URL; PackageDescription: 4-Pin SOT-223 Package, 6.5 x 3.5 mm Body, 2.3 mm Pitch, 7 mm Lead Span
Um2 = CMP-0244-00310-1: Fixed Low Drop Positive Voltage Regulator, 3.3V, 4-Pin SOT-223, Tape and Reel; ComponentLink2Description: Datasheet; PackageDescription: 4-Pin SOT-223 Package, 6.5 x 3.5 mm Body, 2.3 mm Pitch, 7 mm Lead Span; PackageVersion: 2010; ComponentLink2URL: http://www.st.com/internet/com/TECHNICAL_RESOURCES/TECHNICAL_LITERATURE/DATASHEET/CD00000544.pdf; PackageReference: SOT-223; DatasheetVersion: 1/11/2011; ComponentLink1Description: Manufacturer URL; ComponentLink1URL: http://www.st.com

## Nets that join several sheets
3.3V: Connectors (I2C_CON.6 PWR_CON.3 Qc1.3 SPI_CON.7), MCU (12 pins), Analiser (Ca6.2 Oa1.4), Misc (5 pins)
5V: Scanners (64 pins), Connectors (9 pins), Analiser (8 pins), Misc (7 pins)
GND: Scanners (17 pins), Connectors (29 pins), MCU (18 pins), Analiser (11 pins), Misc (14 pins)
Vin: Connectors (JPc1.2 JPc2.2 JPc3.2), Misc (Cm1.1 Um1.3)
AnaliserIN: Scanners (16 pins), Analiser (Ra1.1 Ua1.5)
CS1: Connectors (SPI_CON.5), MCU (U1.20)
MCLK: MCU (U1.56), Analiser (JPa1.1)
MISO: Connectors (SPI_CON.3), MCU (U1.22)
MOSI: Connectors (SPI_CON.2), MCU (U1.23)
NRST: Connectors (Rc2.2), MCU (C5.1 SW1.1 SW1.2 U1.7)
PB0: Scanners (OPTR15.2), MCU (U1.26)
PB1: Scanners (OPTR16.2), MCU (U1.27)
PB2: MCU (U1.28), Misc (Cm7.2 Rm4.1 SWm1.1 SWm1.2)
PB14: MCU (U1.35), Misc (Rm2.2)
PB15: MCU (U1.36), Misc (Rm3.2)
PC0: Scanners (OPTR1.2), MCU (U1.8)
PC1: Scanners (OPTR2.2), MCU (U1.9)
PC2: Scanners (OPTR3.2), MCU (U1.10)
PC3: Scanners (OPTR4.2), MCU (U1.11)
PC4: Scanners (OPTR5.2), MCU (U1.24)
PC5: Scanners (OPTR6.2), MCU (U1.25)
PC6: Scanners (OPTR7.2), MCU (U1.37)
PC7: Scanners (OPTR8.2), MCU (U1.38)
PC8: Scanners (OPTR9.2), MCU (U1.39)
PC9: Scanners (OPTR10.2), MCU (U1.40)
PC10: Scanners (OPTR11.2), MCU (U1.51)
PC11: Scanners (OPTR12.2), MCU (U1.52)
PC12: Scanners (OPTR13.2), MCU (U1.53)
PC13: Scanners (OPTR14.2), MCU (U1.2)
SCK: Connectors (SPI_CON.4), MCU (U1.21)
SCL: MCU (U1.58), Analiser (Ua1.16)
SCL2: Connectors (I2C_CON.3), MCU (U1.29)
SDA: MCU (U1.59), Analiser (Ua1.15)
SDA2: Connectors (I2C_CON.2), MCU (U1.30)
SWO: Connectors (Rc1.2), MCU (U1.55)
TCK: Connectors (Rc4.2), MCU (U1.49)
TMS: Connectors (Rc3.2), MCU (U1.46)
UART_RX: Connectors (Uc1.5), MCU (U1.43)
UART_TX: Connectors (Uc1.1), MCU (U1.42)
USB_DM: Connectors (Rc6.2), MCU (U1.44)
USB_DP: Connectors (Rc7.2), MCU (U1.45)
USB_EN: Connectors (Rc5.1), MCU (U1.50)